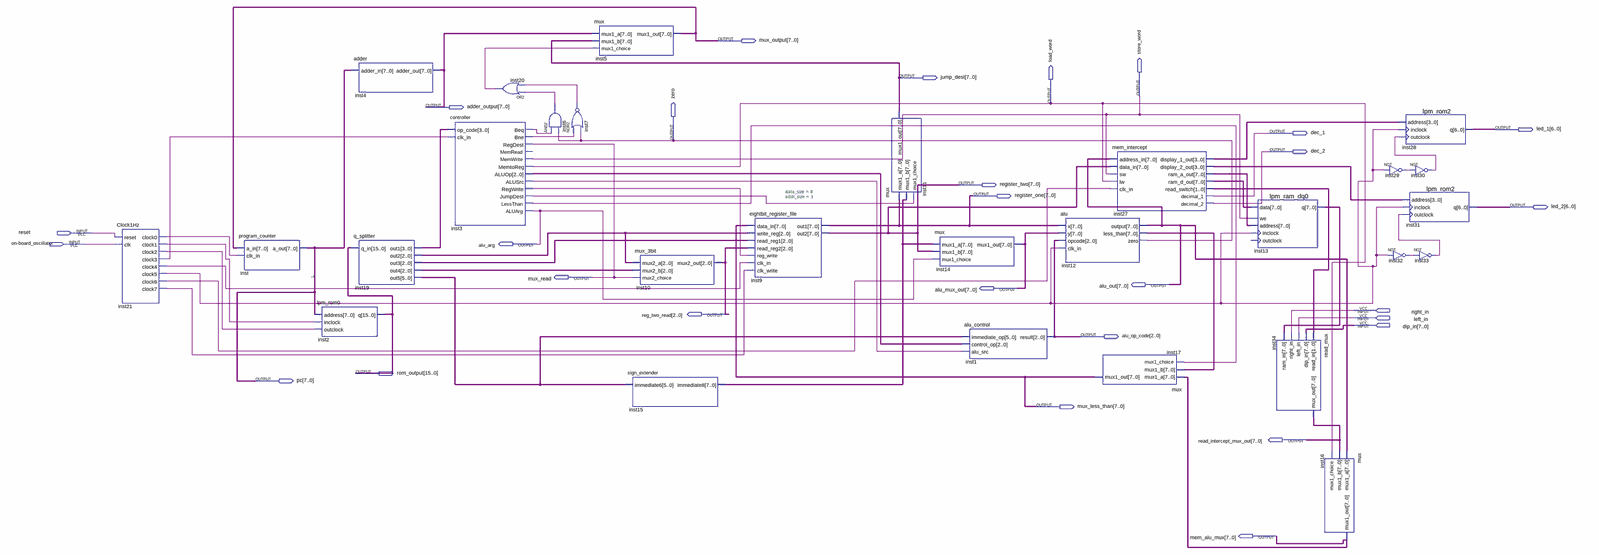
[diagram p0: schematic sheet, whole]
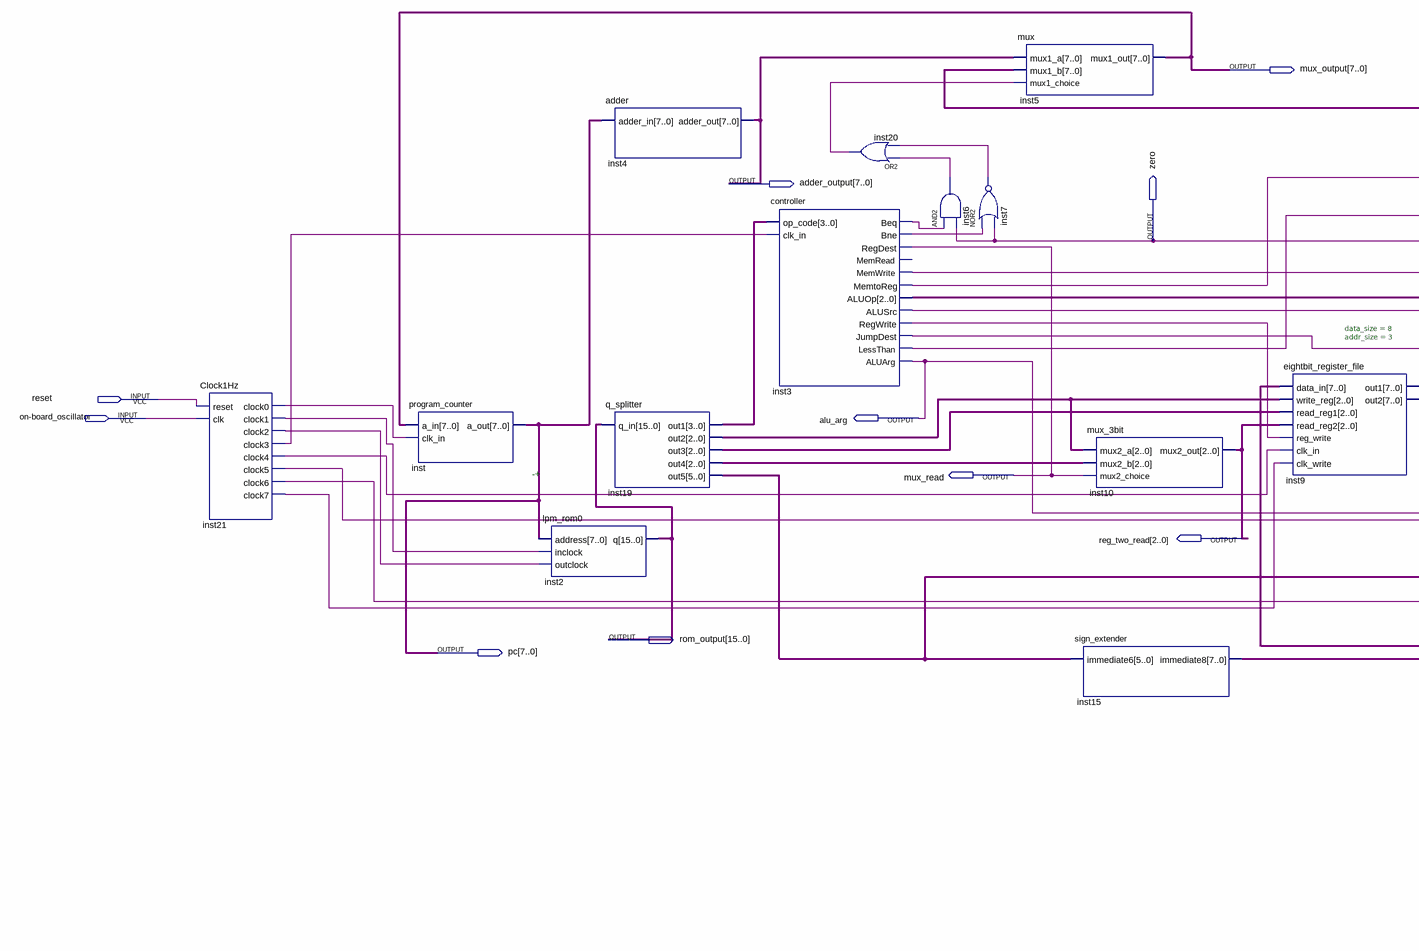
[diagram p1: schematic sheet, left part]
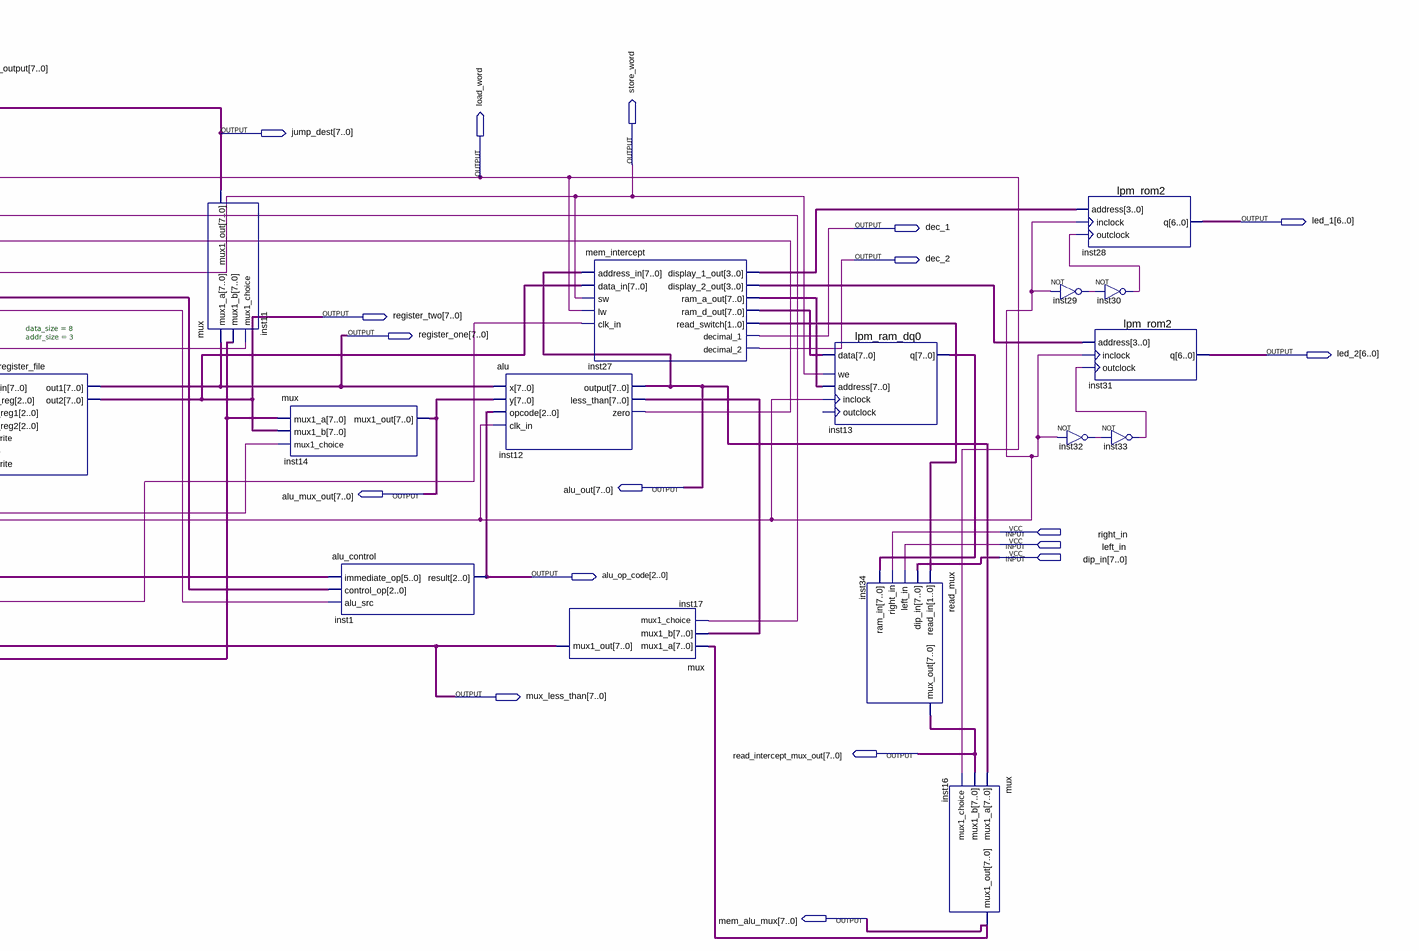
[diagram p2: schematic sheet, right part]
// Quartus schematic processor.bdf as structural Verilog: 28 symbols, 28 pins
module processor (
  input  reset,
  input  \on-board_oscillator ,
  input  right_in,
  input  left_in,
  input  [7:0] dip_in,
  output [7:0] mux_output,
  output [7:0] jump_dest,
  output store_word,
  output load_word,
  output [7:0] adder_output,
  output [6:0] led_1,
  output dec_1,
  output zero,
  output dec_2,
  output [7:0] register_two,
  output [7:0] register_one,
  output [6:0] led_2,
  output alu_arg,
  output mux_read,
  output [7:0] alu_out,
  output [7:0] alu_mux_out,
  output [2:0] reg_two_read,
  output [2:0] alu_op_code,
  output [15:0] rom_output,
  output [7:0] pc,
  output [7:0] mux_less_than,
  output [7:0] read_intercept_mux_out,
  output [7:0] mem_alu_mux
);

  wire inst3_alusrc, inst3_beq, inst3_bne, inst3_jumpdest, inst3_lessthan, inst3_regwrite, inst6_out,
       inst7_out, inst20_out, inst21_clock0, inst21_clock1, inst21_clock2, inst21_clock3, inst21_clock4,
       inst21_clock5, inst21_clock6, inst21_clock7, inst29_out, inst30_out, inst32_out, inst33_out;
  wire [1:0] inst27_read_switch;
  wire [2:0] inst3_aluop, inst19_out2, inst19_out3, inst19_out4;
  wire [3:0] inst19_out1, inst27_display_1_out, inst27_display_2_out;
  wire [5:0] inst19_out5;
  wire [7:0] inst12_less_than, inst13_q, inst15_immediate8, inst27_ram_a_out, inst27_ram_d_out;

  Clock1Hz inst21 (
    .reset(reset), .clk(\on-board_oscillator ), .clock0(inst21_clock0), .clock1(inst21_clock1),
    .clock2(inst21_clock2), .clock3(inst21_clock3), .clock4(inst21_clock4), .clock5(inst21_clock5),
    .clock6(inst21_clock6), .clock7(inst21_clock7));
  program_counter inst (.a_in(mux_output), .clk_in(inst21_clock0), .a_out(pc));
  lpm_rom0 inst2 (.address(pc), .inclock(inst21_clock1), .outclock(inst21_clock2), .q(rom_output));
  adder inst4 (.adder_in(pc), .adder_out(adder_output));
  q_splitter inst19 (
    .q_in(rom_output), .out1(inst19_out1), .out2(inst19_out2), .out3(inst19_out3), .out4(inst19_out4),
    .out5(inst19_out5));
  controller inst3 (
    .op_code(inst19_out1), .clk_in(inst21_clock3), .Beq(inst3_beq), .Bne(inst3_bne), .RegDest(mux_read),
    .MemWrite(store_word), .MemtoReg(load_word), .ALUOp(inst3_aluop), .ALUSrc(inst3_alusrc),
    .RegWrite(inst3_regwrite), .JumpDest(inst3_jumpdest), .LessThan(inst3_lessthan), .ALUArg(alu_arg));  // open: MemRead
  or inst20 (inst20_out, inst6_out, inst7_out);
  and inst6 (inst6_out, inst3_beq, zero);
  nor inst7 (inst7_out, inst3_bne, zero);
  mux inst5 (.mux1_a(adder_output), .mux1_b(jump_dest), .mux1_choice(inst20_out), .mux1_out(mux_output));
  mux_3bit inst10 (.mux2_a(inst19_out2), .mux2_b(inst19_out4), .mux2_choice(mux_read), .mux2_out(reg_two_read));
  sign_extender inst15 (.immediate6(inst19_out5), .immediate8(inst15_immediate8));
  eightbit_register_file #(.data_size(8), .addr_size(3)) inst9 (
    .data_in(mux_less_than), .write_reg(inst19_out2), .read_reg1(inst19_out3), .read_reg2(reg_two_read),
    .reg_write(inst3_regwrite), .clk_in(inst21_clock4), .clk_write(inst21_clock7), .out1(register_one),
    .out2(register_two));
  mux inst11 (.mux1_a(register_one), .mux1_b(inst15_immediate8), .mux1_choice(inst3_jumpdest), .mux1_out(jump_dest));
  mux inst14 (.mux1_a(inst15_immediate8), .mux1_b(register_two), .mux1_choice(alu_arg), .mux1_out(alu_mux_out));
  alu_control inst1 (
    .immediate_op(inst19_out5), .control_op(inst3_aluop), .alu_src(inst3_alusrc), .result(alu_op_code));
  alu inst12 (
    .x(register_one), .y(alu_mux_out), .opcode(alu_op_code), .clk_in(inst21_clock5), .\output (alu_out),
    .less_than(inst12_less_than), .zero(zero));
  mem_intercept inst27 (
    .address_in(alu_out), .data_in(register_two), .sw(store_word), .lw(load_word), .clk_in(inst21_clock6),
    .display_1_out(inst27_display_1_out), .display_2_out(inst27_display_2_out), .ram_a_out(inst27_ram_a_out),
    .ram_d_out(inst27_ram_d_out), .read_switch(inst27_read_switch), .decimal_1(dec_1), .decimal_2(dec_2));
  mux inst17 (.mux1_a(mem_alu_mux), .mux1_b(inst12_less_than), .mux1_choice(inst3_lessthan), .mux1_out(mux_less_than));
  lpm_ram_dq0 inst13 (
    .data(inst27_ram_d_out), .we(store_word), .address(inst27_ram_a_out), .inclock(inst21_clock5),
    .q(inst13_q));  // open: outclock
  read_mux inst34 (
    .read_in(inst27_read_switch), .dip_in(dip_in), .left_in(left_in), .right_in(right_in), .ram_in(inst13_q),
    .mux_out(read_intercept_mux_out));
  mux inst16 (.mux1_a(alu_out), .mux1_b(read_intercept_mux_out), .mux1_choice(load_word), .mux1_out(mem_alu_mux));
  lpm_rom2 inst28 (.address(inst27_display_1_out), .inclock(inst21_clock5), .outclock(inst30_out), .q(led_1));
  not inst29 (inst29_out, inst21_clock5);
  lpm_rom2 inst31 (.address(inst27_display_2_out), .inclock(inst21_clock5), .outclock(inst33_out), .q(led_2));
  not inst32 (inst32_out, inst21_clock5);
  not inst30 (inst30_out, inst29_out);
  not inst33 (inst33_out, inst32_out);

  // Notes on the sheet:
  //   -+
endmodule
